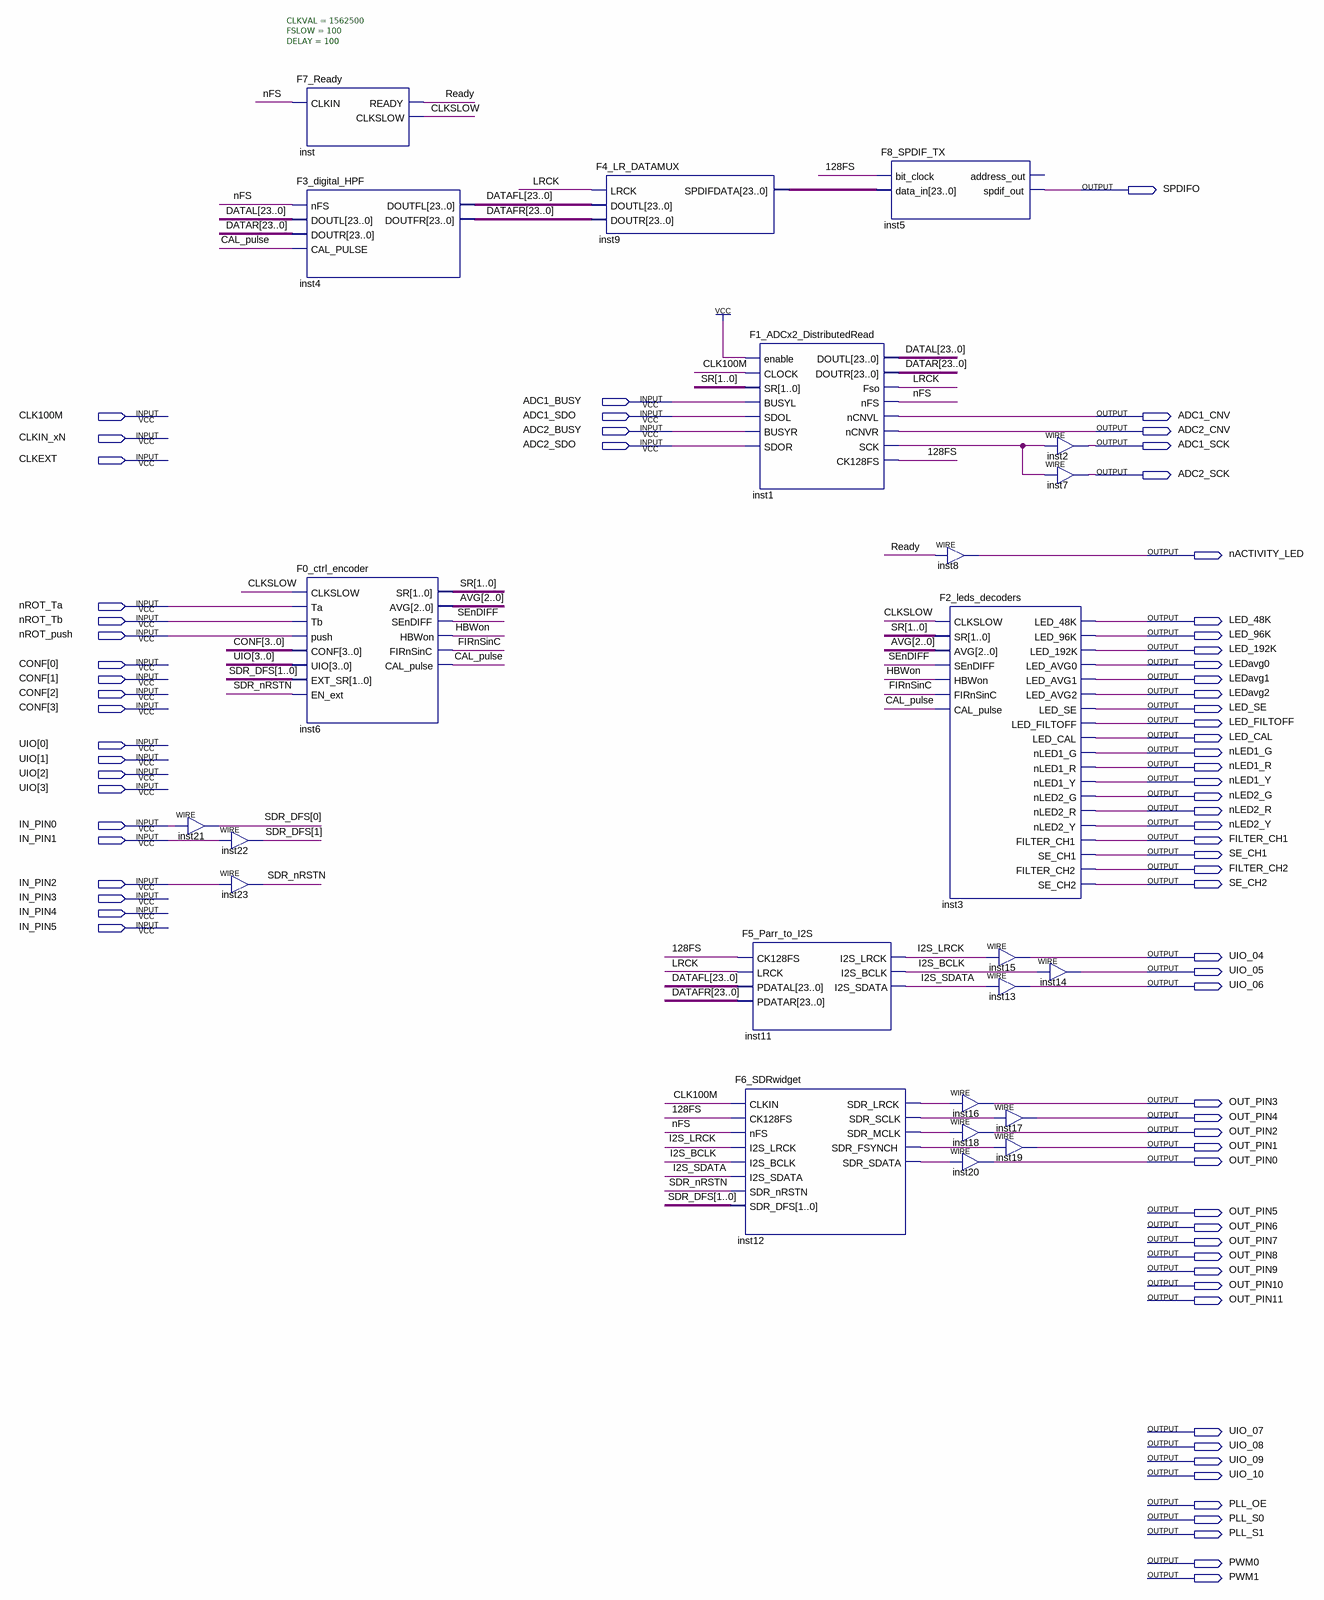
[diagram p0: schematic sheet]
// Quartus schematic AA2380_MAXV.bdf as structural Verilog: 23 symbols, 73 pins
module AA2380_MAXV (
  input  ADC1_BUSY,
  input  CLK100M,
  input  ADC1_SDO,
  input  ADC2_BUSY,
  input  CLKIN_xN,
  input  ADC2_SDO,
  input  CLKEXT,
  input  nROT_Ta,
  input  nROT_Tb,
  input  nROT_push,
  input  [3:0] CONF,
  input  [3:0] UIO,
  input  IN_PIN0,
  input  IN_PIN1,
  input  IN_PIN2,
  input  IN_PIN3,
  input  IN_PIN4,
  input  IN_PIN5,
  output SPDIFO,
  output ADC1_CNV,
  output ADC2_CNV,
  output ADC1_SCK,
  output ADC2_SCK,
  output nACTIVITY_LED,
  output LED_48K,
  output LED_96K,
  output LED_192K,
  output LEDavg0,
  output LEDavg1,
  output LEDavg2,
  output LED_SE,
  output LED_FILTOFF,
  output LED_CAL,
  output nLED1_G,
  output nLED1_R,
  output nLED1_Y,
  output nLED2_G,
  output nLED2_R,
  output nLED2_Y,
  output FILTER_CH1,
  output SE_CH1,
  output FILTER_CH2,
  output SE_CH2,
  output UIO_04,
  output UIO_05,
  output UIO_06,
  output OUT_PIN3,
  output OUT_PIN4,
  output OUT_PIN2,
  output OUT_PIN1,
  output OUT_PIN0,
  output OUT_PIN5,
  output OUT_PIN6,
  output OUT_PIN7,
  output OUT_PIN8,
  output OUT_PIN9,
  output OUT_PIN10,
  output OUT_PIN11,
  output UIO_07,
  output UIO_08,
  output UIO_09,
  output UIO_10,
  output PLL_OE,
  output PLL_S0,
  output PLL_S1,
  output PWM0,
  output PWM1
);

  wire \128FS , CAL_pulse, CLKSLOW, FIRnSinC, HBWon, I2S_BCLK, I2S_LRCK, I2S_SDATA, inst1_sck,
       inst12_sdr_fsynch, inst12_sdr_lrck, inst12_sdr_mclk, inst12_sdr_sclk, inst12_sdr_sdata, LRCK, nFS,
       Ready, SDR_nRSTN, SEnDIFF;
  wire [1:0] SDR_DFS, SR;
  wire [2:0] AVG;
  wire [23:0] DATAFL, DATAFR, DATAL, DATAR, inst9_spdifdata;

  assign SDR_DFS[0] = IN_PIN0;  // WIRE inst21
  assign SDR_DFS[1] = IN_PIN1;  // WIRE inst22
  assign SDR_nRSTN = IN_PIN2;  // WIRE inst23
  F7_Ready #(.CLKVAL(1562500), .FSLOW(100), .DELAY(100)) inst (.CLKIN(nFS), .READY(Ready), .CLKSLOW(CLKSLOW));
  F3_digital_HPF inst4 (
    .nFS(nFS), .DOUTL(DATAL), .DOUTR(DATAR), .CAL_PULSE(CAL_pulse), .DOUTFL(DATAFL), .DOUTFR(DATAFR));
  F0_ctrl_encoder inst6 (
    .CLKSLOW(CLKSLOW), .Ta(nROT_Ta), .Tb(nROT_Tb), .push(nROT_push), .CONF(CONF), .UIO(UIO),
    .EXT_SR(SDR_DFS), .EN_ext(SDR_nRSTN), .SR(SR), .AVG(AVG), .SEnDIFF(SEnDIFF), .HBWon(HBWon),
    .FIRnSinC(FIRnSinC), .CAL_pulse(CAL_pulse));
  F4_LR_DATAMUX inst9 (.LRCK(LRCK), .DOUTL(DATAFL), .DOUTR(DATAFR), .SPDIFDATA(inst9_spdifdata));
  F5_Parr_to_I2S inst11 (
    .CK128FS(\128FS ), .LRCK(LRCK), .PDATAL(DATAFL), .PDATAR(DATAFR), .I2S_LRCK(I2S_LRCK),
    .I2S_BCLK(I2S_BCLK), .I2S_SDATA(I2S_SDATA));
  F6_SDRwidget inst12 (
    .CLKIN(CLK100M), .CK128FS(\128FS ), .nFS(nFS), .I2S_LRCK(I2S_LRCK), .I2S_BCLK(I2S_BCLK),
    .I2S_SDATA(I2S_SDATA), .SDR_nRSTN(SDR_nRSTN), .SDR_DFS(SDR_DFS), .SDR_LRCK(inst12_sdr_lrck),
    .SDR_SCLK(inst12_sdr_sclk), .SDR_MCLK(inst12_sdr_mclk), .SDR_FSYNCH(inst12_sdr_fsynch),
    .SDR_SDATA(inst12_sdr_sdata));
  F1_ADCx2_DistributedRead inst1 (
    .enable(1'b1), .CLOCK(CLK100M), .SR(SR), .BUSYL(ADC1_BUSY), .SDOL(ADC1_SDO), .BUSYR(ADC2_BUSY),
    .SDOR(ADC2_SDO), .DOUTL(DATAL), .DOUTR(DATAR), .Fso(LRCK), .nFS(nFS), .nCNVL(ADC1_CNV), .nCNVR(ADC2_CNV),
    .SCK(inst1_sck), .CK128FS(\128FS ));
  F8_SPDIF_TX inst5 (.bit_clock(\128FS ), .data_in(inst9_spdifdata), .spdif_out(SPDIFO));  // open: address_out
  assign nACTIVITY_LED = Ready;  // WIRE inst8
  F2_leds_decoders inst3 (
    .CLKSLOW(CLKSLOW), .SR(SR), .AVG(AVG), .SEnDIFF(SEnDIFF), .HBWon(HBWon), .FIRnSinC(FIRnSinC),
    .CAL_pulse(CAL_pulse), .LED_48K(LED_48K), .LED_96K(LED_96K), .LED_192K(LED_192K), .LED_AVG0(LEDavg0),
    .LED_AVG1(LEDavg1), .LED_AVG2(LEDavg2), .LED_SE(LED_SE), .LED_FILTOFF(LED_FILTOFF), .LED_CAL(LED_CAL),
    .nLED1_G(nLED1_G), .nLED1_R(nLED1_R), .nLED1_Y(nLED1_Y), .nLED2_G(nLED2_G), .nLED2_R(nLED2_R),
    .nLED2_Y(nLED2_Y), .FILTER_CH1(FILTER_CH1), .SE_CH1(SE_CH1), .FILTER_CH2(FILTER_CH2), .SE_CH2(SE_CH2));
  assign OUT_PIN3 = inst12_sdr_lrck;  // WIRE inst16
  assign OUT_PIN2 = inst12_sdr_mclk;  // WIRE inst18
  assign OUT_PIN0 = inst12_sdr_sdata;  // WIRE inst20
  assign UIO_04 = I2S_LRCK;  // WIRE inst15
  assign UIO_06 = I2S_SDATA;  // WIRE inst13
  assign OUT_PIN4 = inst12_sdr_sclk;  // WIRE inst17
  assign OUT_PIN1 = inst12_sdr_fsynch;  // WIRE inst19
  assign ADC1_SCK = inst1_sck;  // WIRE inst2
  assign ADC2_SCK = inst1_sck;  // WIRE inst7
  assign UIO_05 = I2S_BCLK;  // WIRE inst14
endmodule
